# Altium schematic sheet MC21R01_uC_ADC.SchDoc: MC21R01 Top Level
size A3; Author: AMP; DrawnBy: AMP; Organization: Altium Limited; Address1: 3 Minna Close; Address2: Belrose; Address3: NSW 2085; Address4: Australia; DocumentNumber: 0; Revision: 1.0; SheetNumber: 0; SheetTotal: 0
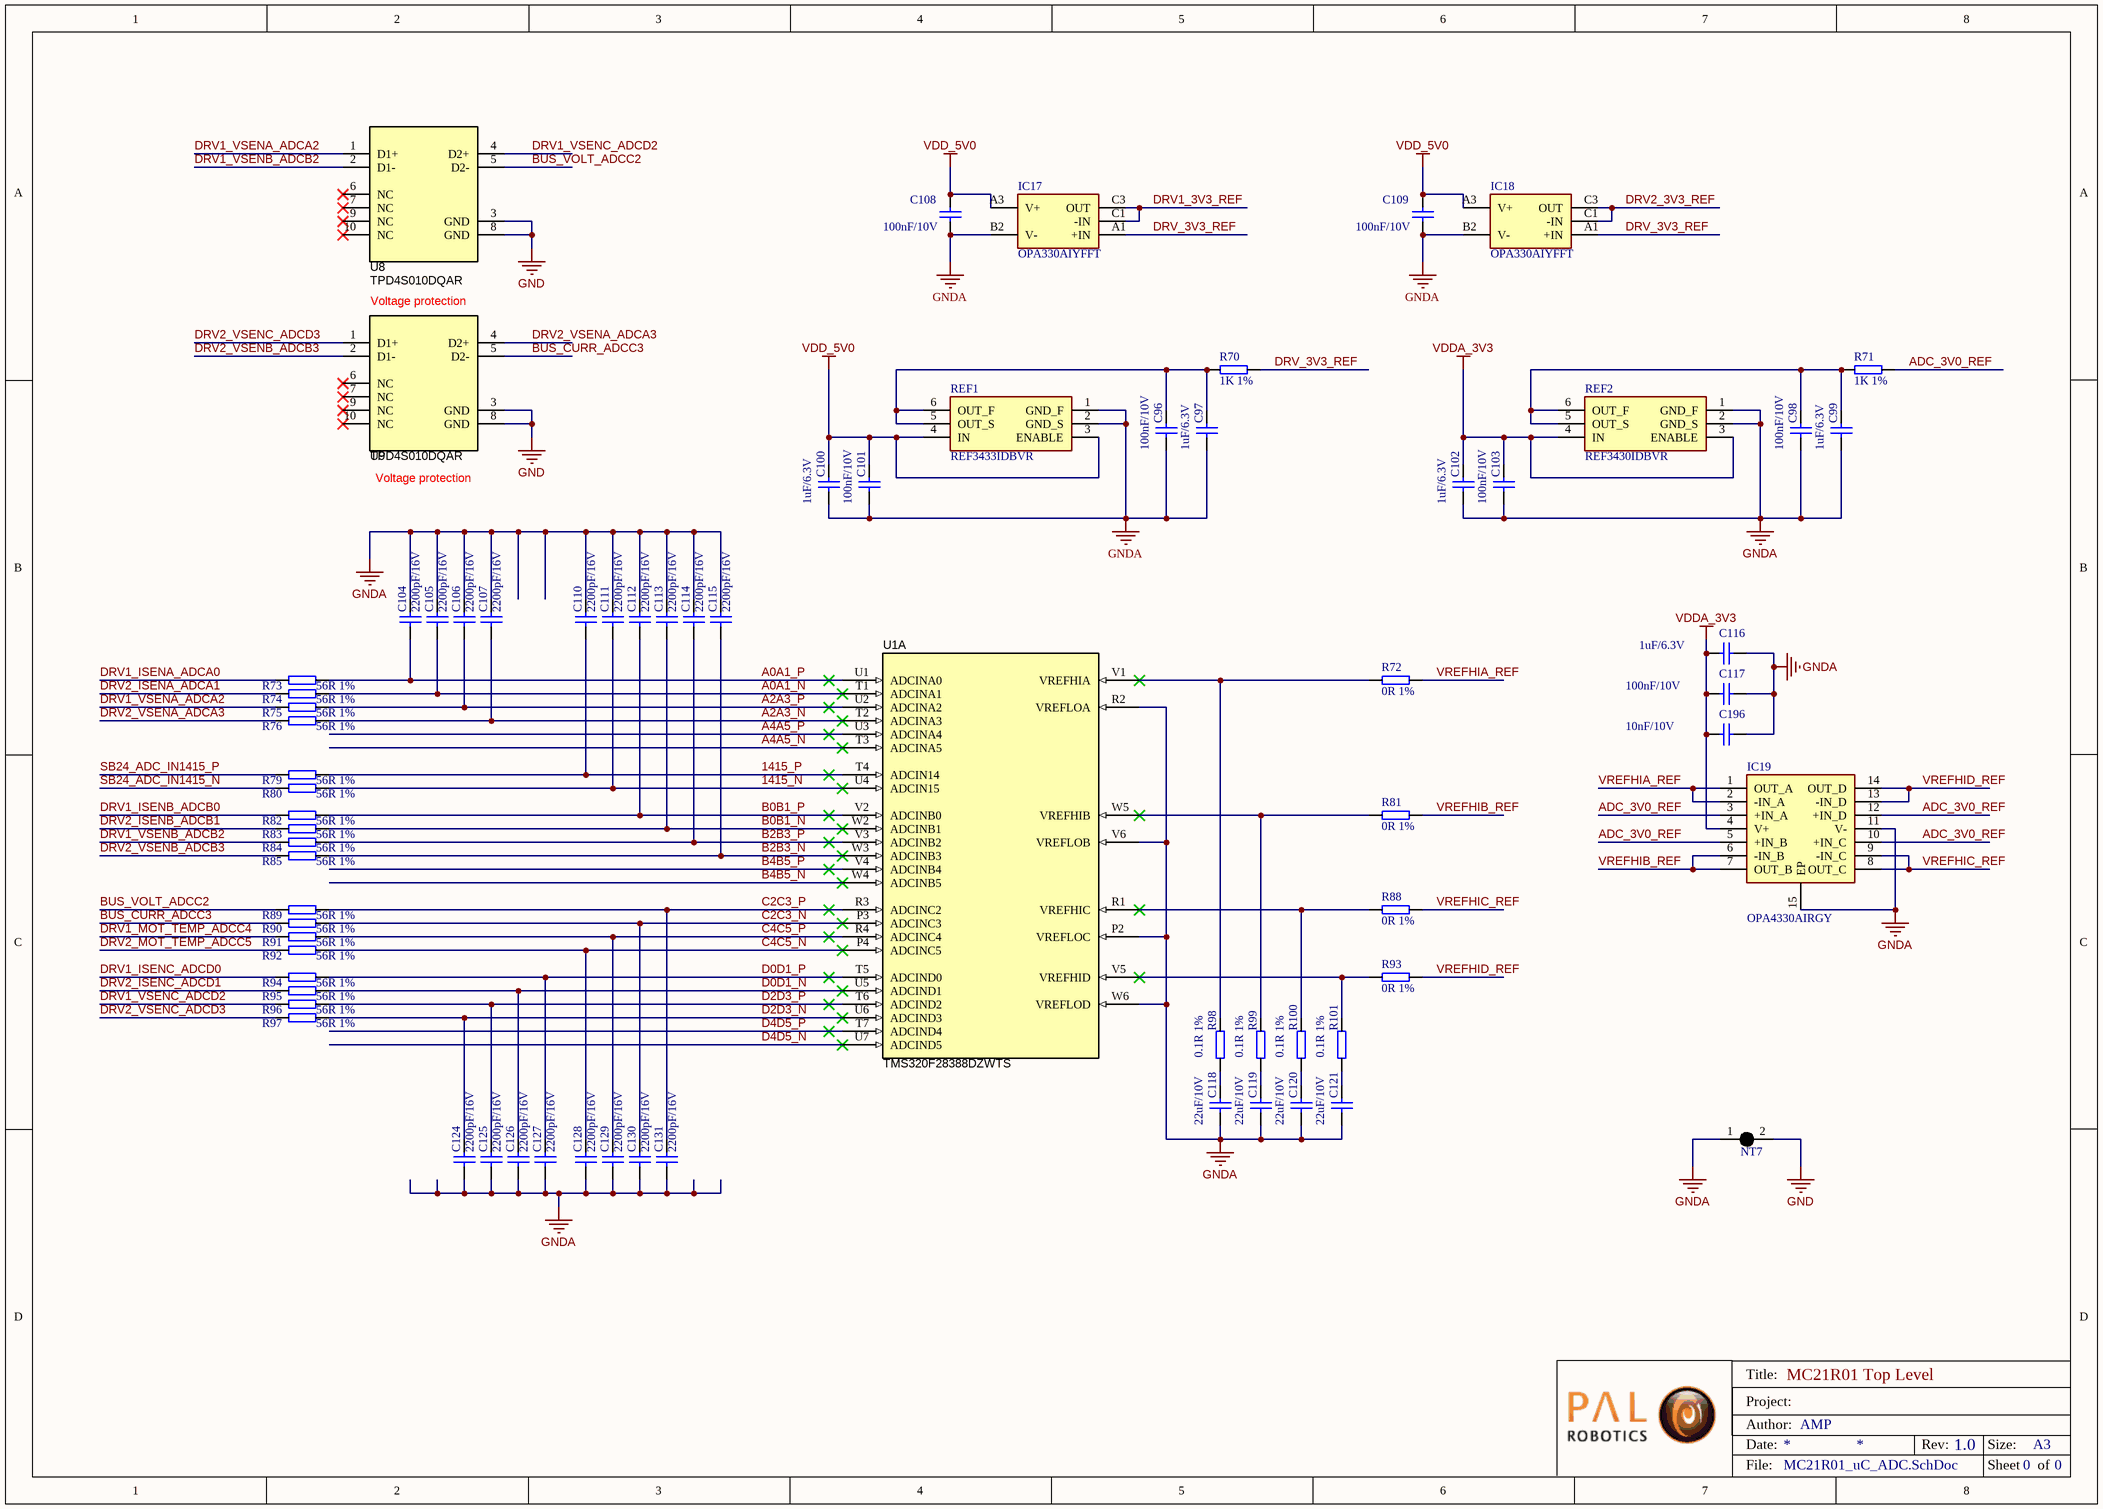
[diagram p0: MC21R01_uC_ADC.SchDoc]

## Parts
C96  value 100nF/10V  [0402 SMD Capacitor]  (hidden comment: 100nF/10V 0402 20% X5R)
C97  value 1uF/6.3V  [0402 SMD Capacitor]  (hidden comment: 1uF/6.3V 0402 10% X5R)
C98  value 100nF/10V  [0402 SMD Capacitor]  (hidden comment: 100nF/10V 0402 20% X5R)
C99  value 1uF/6.3V  [0402 SMD Capacitor]  (hidden comment: 1uF/6.3V 0402 10% X5R)
C100  value 1uF/6.3V  [0402 SMD Capacitor]  (hidden comment: 1uF/6.3V 0402 10% X5R)
C101  value 100nF/10V  [0402 SMD Capacitor]  (hidden comment: 100nF/10V 0402 20% X5R)
C102  value 1uF/6.3V  [0402 SMD Capacitor]  (hidden comment: 1uF/6.3V 0402 10% X5R)
C103  value 100nF/10V  [0402 SMD Capacitor]  (hidden comment: 100nF/10V 0402 20% X5R)
C104  value 2200pF/16V  [0402 SMD Capacitor]  (hidden comment: 2200pF/16V 0402 10% X7R)
C105  value 2200pF/16V  [0402 SMD Capacitor]  (hidden comment: 2200pF/16V 0402 10% X7R)
C106  value 2200pF/16V  [0402 SMD Capacitor]  (hidden comment: 2200pF/16V 0402 10% X7R)
C107  value 2200pF/16V  [0402 SMD Capacitor]  (hidden comment: 2200pF/16V 0402 10% X7R)
C108  value 100nF/10V  [0402 SMD Capacitor]  (hidden comment: 100nF/10V 0402 20% X5R)
C109  value 100nF/10V  [0402 SMD Capacitor]  (hidden comment: 100nF/10V 0402 20% X5R)
C110  value 2200pF/16V  [0402 SMD Capacitor]  (hidden comment: 2200pF/16V 0402 10% X7R)
C111  value 2200pF/16V  [0402 SMD Capacitor]  (hidden comment: 2200pF/16V 0402 10% X7R)
C112  value 2200pF/16V  [0402 SMD Capacitor]  (hidden comment: 2200pF/16V 0402 10% X7R)
C113  value 2200pF/16V  [0402 SMD Capacitor]  (hidden comment: 2200pF/16V 0402 10% X7R)
C114  value 2200pF/16V  [0402 SMD Capacitor]  (hidden comment: 2200pF/16V 0402 10% X7R)
C115  value 2200pF/16V  [0402 SMD Capacitor]  (hidden comment: 2200pF/16V 0402 10% X7R)
C116  value 1uF/6.3V  [0402 SMD Capacitor]  (hidden comment: 1uF/6.3V 0402 10% X5R)
C117  value 100nF/10V  [0402 SMD Capacitor]  (hidden comment: 100nF/10V 0402 20% X5R)
C118  value 22uF/10V  [0603 SMD capacitor]  (hidden comment: 22uF/10V 0603 20% X5R)
C119  value 22uF/10V  [0603 SMD capacitor]  (hidden comment: 22uF/10V 0603 20% X5R)
C120  value 22uF/10V  [0603 SMD capacitor]  (hidden comment: 22uF/10V 0603 20% X5R)
C121  value 22uF/10V  [0603 SMD capacitor]  (hidden comment: 22uF/10V 0603 20% X5R)
C124  value 2200pF/16V  [0402 SMD Capacitor]  (hidden comment: 2200pF/16V 0402 10% X7R)
C125  value 2200pF/16V  [0402 SMD Capacitor]  (hidden comment: 2200pF/16V 0402 10% X7R)
C126  value 2200pF/16V  [0402 SMD Capacitor]  (hidden comment: 2200pF/16V 0402 10% X7R)
C127  value 2200pF/16V  [0402 SMD Capacitor]  (hidden comment: 2200pF/16V 0402 10% X7R)
C128  value 2200pF/16V  [0402 SMD Capacitor]  (hidden comment: 2200pF/16V 0402 10% X7R)
C129  value 2200pF/16V  [0402 SMD Capacitor]  (hidden comment: 2200pF/16V 0402 10% X7R)
C130  value 2200pF/16V  [0402 SMD Capacitor]  (hidden comment: 2200pF/16V 0402 10% X7R)
C131  value 2200pF/16V  [0402 SMD Capacitor]  (hidden comment: 2200pF/16V 0402 10% X7R)
C196  value 10nF/10V  [0402 SMD Capacitor]  (hidden comment: 10nF/10V 0402 20% X5R)
IC17  OPA330AIYFFT  [OPA330 DSBGA]
IC18  OPA330AIYFFT  [OPA330 DSBGA]
IC19  OPA4330AIRGY  [OPA4330 RGY]
NT7  Net Tie SMD  [Net Tie SMD 0.4x0.8mm]  (value not drawn)  (net tie, no BOM)
R70  1K 1%  [0402 SMD rESISTOR]
R71  1K 1%  [0402 SMD rESISTOR]
R72  0R 1%  [0402 SMD rESISTOR]
R73  56R 1%  [0402 SMD rESISTOR]
R74  56R 1%  [0402 SMD rESISTOR]
R75  56R 1%  [0402 SMD rESISTOR]
R76  56R 1%  [0402 SMD rESISTOR]
R79  56R 1%  [0402 SMD rESISTOR]
R80  56R 1%  [0402 SMD rESISTOR]
R81  0R 1%  [0402 SMD rESISTOR]
R82  56R 1%  [0402 SMD rESISTOR]
R83  56R 1%  [0402 SMD rESISTOR]
R84  56R 1%  [0402 SMD rESISTOR]
R85  56R 1%  [0402 SMD rESISTOR]
R88  0R 1%  [0402 SMD rESISTOR]
R89  56R 1%  [0402 SMD rESISTOR]
R90  56R 1%  [0402 SMD rESISTOR]
R91  56R 1%  [0402 SMD rESISTOR]
R92  56R 1%  [0402 SMD rESISTOR]
R93  0R 1%  [0402 SMD rESISTOR]
R94  56R 1%  [0402 SMD rESISTOR]
R95  56R 1%  [0402 SMD rESISTOR]
R96  56R 1%  [0402 SMD rESISTOR]
R97  56R 1%  [0402 SMD rESISTOR]
R98  0.1R 1%  [0402 SMD rESISTOR]
R99  0.1R 1%  [0402 SMD rESISTOR]
R100  0.1R 1%  [0402 SMD rESISTOR]
R101  0.1R 1%  [0402 SMD rESISTOR]
REF1  REF3433IDBVR  [SOT95P280X145-6N]
REF2  REF3430IDBVR  [SOT95P280X145-6N]
U1  TMS320F28388DZWTS  [ZWT0337A]  (part A of 5)
U8  TPD4S010DQAR  [DQA0010A]
U9  TPD4S010DQAR  [DQA0010A]

## Nets
GND: NT7.2 U8.3(GND) U8.8(GND) U9.3(GND) U9.8(GND)
GNDA: C96.2 C97.2 C98.2 C99.2 C100.2 C101.2 C102.2 C103.2 C104.1 C105.1 C106.1 C107.1 C108.1 C109.1 C110.1 C111.1 C112.1 C113.1 C114.1 C115.1 C116.2 C117.2 C118.2 C119.2 C120.2 C121.2 C124.2 C125.2 C126.2 C127.2 C128.2 C129.2 C130.2 C131.2 C196.2 IC17.B2(V-) IC18.B2(V-) IC19.11(V-) IC19.15(EP) NT7.1 REF1.1(GND_F) REF1.2(GND_S) REF2.1(GND_F) REF2.2(GND_S) U1.P2(VREFLOC) U1.R2(VREFLOA) U1.V6(VREFLOB) U1.W6(VREFLOD)
VDD_5V0: C100.1 C101.1 C108.2 C109.2 IC17.A3(V+) IC18.A3(V+) REF1.3(ENABLE) REF1.4(IN)
VDDA_3V3: C102.1 C103.1 C116.1 C117.1 C196.1 IC19.4(V+) REF2.3(ENABLE) REF2.4(IN)
1415_N: C111.2 R80.1 U1.U4(ADCIN15)
1415_P: C110.2 R79.1 U1.T4(ADCIN14)
A0A1_N: C105.2 R74.1 U1.T1(ADCINA1)
A0A1_P: C104.2 R73.1 U1.U1(ADCINA0)
A2A3_N: C107.2 R76.1 U1.T2(ADCINA3)
A2A3_P: C106.2 R75.1 U1.U2(ADCINA2)
A4A5_N: U1.T3(ADCINA5)
A4A5_P: U1.U3(ADCINA4)
ADC_3V0_REF: IC19.3(+IN_A) IC19.5(+IN_B) IC19.10(+IN_C) IC19.12(+IN_D) R71.1
B0B1_N: C113.2 R83.1 U1.W2(ADCINB1)
B0B1_P: C112.2 R82.1 U1.V2(ADCINB0)
B2B3_N: C115.2 R85.1 U1.W3(ADCINB3)
B2B3_P: C114.2 R84.1 U1.V3(ADCINB2)
B4B5_N: U1.W4(ADCINB5)
B4B5_P: U1.V4(ADCINB4)
BUS_CURR_ADCC3: R90.2 U9.5(D2-)
BUS_VOLT_ADCC2: R89.2 U8.5(D2-)
C2C3_N: C130.1 R90.1 U1.P3(ADCINC3)
C2C3_P: C131.1 R89.1 U1.R3(ADCINC2)
C4C5_N: C128.1 R92.1 U1.P4(ADCINC5)
C4C5_P: C129.1 R91.1 U1.R4(ADCINC4)
D0D1_N: C126.1 R95.1 U1.U5(ADCIND1)
D0D1_P: C127.1 R94.1 U1.T5(ADCIND0)
D2D3_N: C124.1 R97.1 U1.U6(ADCIND3)
D2D3_P: C125.1 R96.1 U1.T6(ADCIND2)
D4D5_N: U1.U7(ADCIND5)
D4D5_P: U1.T7(ADCIND4)
DRV1_3V3_REF: IC17.C1(-IN) IC17.C3(OUT)
DRV1_ISENA_ADCA0: R73.2
DRV1_ISENB_ADCB0: R82.2
DRV1_ISENC_ADCD0: R94.2
DRV1_MOT_TEMP_ADCC4: R91.2
DRV1_VSENA_ADCA2: R75.2 U8.1(D1+)
DRV1_VSENB_ADCB2: R84.2 U8.2(D1-)
DRV1_VSENC_ADCD2: R96.2 U8.4(D2+)
DRV2_3V3_REF: IC18.C1(-IN) IC18.C3(OUT)
DRV2_ISENA_ADCA1: R74.2
DRV2_ISENB_ADCB1: R83.2
DRV2_ISENC_ADCD1: R95.2
DRV2_MOT_TEMP_ADCC5: R92.2
DRV2_VSENA_ADCA3: R76.2 U9.4(D2+)
DRV2_VSENB_ADCB3: R85.2 U9.2(D1-)
DRV2_VSENC_ADCD3: R97.2 U9.1(D1+)
DRV_3V3_REF: IC17.A1(+IN) IC18.A1(+IN) R70.1
SB24_ADC_IN1415_N: R80.2
SB24_ADC_IN1415_P: R79.2
VREFHIA_REF: IC19.1(OUT_A) IC19.2(-IN_A) R72.2
VREFHIB_REF: IC19.6(-IN_B) IC19.7(OUT_B) R81.2
VREFHIC_REF: IC19.8(OUT_C) IC19.9(-IN_C) R88.2
VREFHID_REF: IC19.13(-IN_D) IC19.14(OUT_D) R93.2
NetC96_1: C96.1 C97.1 R70.2 REF1.5(OUT_S) REF1.6(OUT_F)
NetC98_1: C98.1 C99.1 R71.2 REF2.5(OUT_S) REF2.6(OUT_F)
NetC118_1: C118.1 R98.1
NetC119_1: C119.1 R99.1
NetC120_1: C120.1 R100.1
NetC121_1: C121.1 R101.1
NetR72_1: R72.1 R98.2 U1.V1(VREFHIA)
NetR81_1: R81.1 R99.2 U1.W5(VREFHIB)
NetR88_1: R88.1 R100.2 U1.R1(VREFHIC)
NetR93_1: R93.1 R101.2 U1.V5(VREFHID)

Not connected (* = marked no-connect by the designer): U8 6(NC)* 7(NC)* 9(NC)* 10(NC)*; U9 6(NC)* 7(NC)* 9(NC)* 10(NC)*

## Notes on the sheet
- (near U9) Voltage protection
- Title:
- Date:
- Project:
- Author:
- Rev:
- Size:
- A3
- File:
- Sheet
- of

## Library data of the parts
C96 C98 C101 C103 C108 C109 C117 = 100nF/10V 0402 20% X5R: 100nF/10V 0402 20% Tolerance X5R Multilayer Ceramic Chip Capacitor; Manufacturer 1: KEMET; Manufacturer Part Number 1: C0402C104M8PACTU; Supplier Part Number 1: 2810260; Supplier 1: Farnell
C97 C99 C100 C102 C116 = 1uF/6.3V 0402 10% X5R: 1uF/6.3V 0402 10% Tolerance X5R Multilayer Ceramic Chip Capacitor; Manufacturer 1: KEMET; Manufacturer Part Number 1: C0402C105K9PACTU; Supplier Part Number 1: 1288253; Supplier 1: Farnell
C104-C107 C110-C115 C124-C131 = 2200pF/16V 0402 10% X7R_1: 2200pF/16V 0402 10% Tolerance X7R Multilayer Ceramic Chip Capacitor; Manufacturer 1: Walsin; Manufacturer Part Number 1: 0402B222K160CT; Supplier 1: Farnell; Supplier Part Number 1: 2524690
C118-C121 = 22uF/10V 0603 20% X5R: 22 uF 10 V 0603 ±20% Tolerance X5R Multilayer Ceramic Chip Capacitor; Manufacturer 1: Murata; Manufacturer Part Number 1: GRM188R60J106KE47D; Supplier 1: Farnell; Supplier Part Number 1: 2426957
C196 = 10nF/10V 0402 20% X5R: 10nF/10V 0402 20% Tolerance X5R Multilayer Ceramic Chip Capacitor; Manufacturer 1: KEMET; Manufacturer Part Number 1: C0402C103K8PACTU; Supplier Part Number 1: 2773069; Supplier 1: Farnell
IC17 IC18 = OPA330AIYFFT: 1 Channel op amp  0.25-μV/°C, 35-μA CMOS Operational Amplifiers Zero-Drift; Manufacturer_Name: Texas Instruments; Datasheet Link: http://www.ti.com/lit/gpn/opa330; Height: 1.45mm; Manufacturer_Part_Number: OPA330AIYFFT; Supplier Part Number 1: 595-OPA330AIYFFT; Mouser Price/Stock: https://www.mouser.co.uk/ProductDetail/Texas-Instruments/OPA330AIDBVT?qs=DS7Z8uEdLNxVoZWMB%2FsKAQ%3D%3D; RS Part Number: 8122619P; RS Price/Stock: http://uk.rs-online.com/web/p/products/8122619P; Supplier 1: Mouser
IC19 = OPA4330AIRGY: 4 Channel op amp  0.25-μV/°C, 35-μA CMOS Operational Amplifiers Zero-Drift; Manufacturer_Name: Texas Instruments; Manufacturer_Part_Number: OPA4330AIDR; Datasheet Link: http://www.ti.com/lit/gpn/opa4330; Height: 1.75mm; Supplier Part Number 1: 595-OPA4330AIRGYT; Mouser Price/Stock: https://www.mouser.co.uk/ProductDetail/Texas-Instruments/OPA4330AIDR?qs=EuM%2FBx4ov4R6DjwOW%252BMW9A%3D%3D; Supplier 1: Mouser
NT7 = Net Tie SMD: Net Tie starpoint
R70 R71 = 1K/50V 1% 0402 100mW: 1K/50V 1% 0402 100mW SMD Resistor; Manufacturer 1: Yageo; Manufacturer Part Number 1: RC0402FR-071KL; Supplier 1: Mouser; Supplier 2: Farnell; Supplier Part Number 2: 9239235; Supplier Part Number 1: 603-RC0402FR-071KL; Value: 1K
R72 R81 R88 R93 = 0R/50V 1% 0402 100mW: 0R/50V 1% 0402 100mW SMD Resistor; Manufacturer 1: Vishay; Manufacturer Part Number 1: CRCW04020000Z0ED; Supplier 1: Farnell; Supplier Part Number 1: 1469661; Value: 0R
R73-R76 R79 R80 R82-R85 R89-R92 R94-R97 = 56R/50V 1% 0402 100mW: 56R/50V 1% 0402 100mW SMD Resistor; Manufacturer 1: Vishay; Manufacturer Part Number 1: CRCW040256R0FKEDHP; Supplier 1: Farnell; Supplier Part Number 1: 1738833; Value: 56R
R98-R101 = 0.1R/50V 1% 0402 100mW: 0.1R/50V 1% 0402 100mW SMD Resistor; Manufacturer 1: Yageo; Manufacturer Part Number 1: RC0402FR-071KL; Supplier 1: Farnell; Supplier Part Number 1: 1284586; Value: 0.1R
REF1 = REF3433IDBVR: 3V3 Low-drift Low power Voltage reference 10ppm/ºC; Manufacturer_Name: Texas Instruments; Datasheet Link: http://www.ti.com/lit/gpn/ref3430; Height: 1.45mm; Manufacturer_Part_Number: REF3433IDBVR; Supplier Part Number 1: 595-REF3433IDBVR; Supplier 1: Mouser
REF2 = REF3430IDBVR: 3V Low-drift Low power Voltage reference 10ppm/ºC; Manufacturer_Name: Texas Instruments; Datasheet Link: http://www.ti.com/lit/gpn/ref3430; Height: 1.45mm; Manufacturer_Part_Number: REF3430IDBVR; Supplier Part Number 1: 595-REF3430IDBVR; Supplier 1: Mouser
U1 = TMS320F28388: TMS320F28388DZWTS, ZWT0337A (NFBGA-337); Manufacturer: Texas Instruments; SizeAreaWB_mm2: 324; SizeArea_mm2: 256; AEC Qualified: N; AEC Category: Q200; SizeZ_mm: 1.4; SizeY_mm: 16; CompType: IC; ComponentLink1Description: Datasheet Link; ComponentLink2Description: Product Folder; PackageReference: ZWT0337A; PackageDescription: NFBGA-337; ComponentLink2URL: http://www.ti.com/product/tms320f28388d; Alternate Manufacturer: Texas Instruments; ComponentLink3URL: http://www.ti.com/product/tms320f28388d/datasheet; ComponentLink1URL: http://www.ti.com/lit/ds/symlink/tms320f28388d.pdf; MountType: SMT; ComponentLink3Description: Online Datasheet; SizeX_mm: 16; PartNumber: TMS320F28388DZWTS
U8 U9 = TPD4S010DQAR: ESD Solution for High-Speed Differential Interface, 4 Channels, -40 to +85 degC,10-pin SON (DQA), Green (RoHS & no Sb/Br); Manufacturer: Texas Instruments; IO Leakage Current(nA): 10; IO Capacitance(Typ)(pF): 0.8; 1394 / Firewire: TRUE; Breakdown Voltage(Min)(V): 9; Differential Capacitance(pF): 0.05; IEC 61000-4-2 Contact(+/- kV): 8; ComponentLink1URL: http://www.ti.com/; PackageDescription: 10-Pin Plastic Small Outline No-Lead, 1 x 2.5 x 0.55 mm Body, 0.5 mm Pitch; ComponentLink2URL: http://www.ti.com/general/docs/lit/getliterature.tsp?genericPartNumber=TPD4S010&fileType=pdf; Serial ATA / eSATA: TRUE; ComponentLink3Description: URL Link1; Eco-Plan: Green (RoHS & no Sb/Br); ComponentLink2Description: Datasheet; ComponentLink3URL: SamplesURL:http://www.ti.com/product/tpd4s010#samples; PackageReference: DQA0010A; DatasheetVersion: SLVS817E; SubFamily: ESD Solution; PackageVersion: revB, Sep-2009; Mounting Technology: Surface Mount; ComponentLink1Description: Manufacturer URL; IEC 61000-4-2 Air-Gap(+/- kV): 9; PartNumber: TPD4S010DQAR